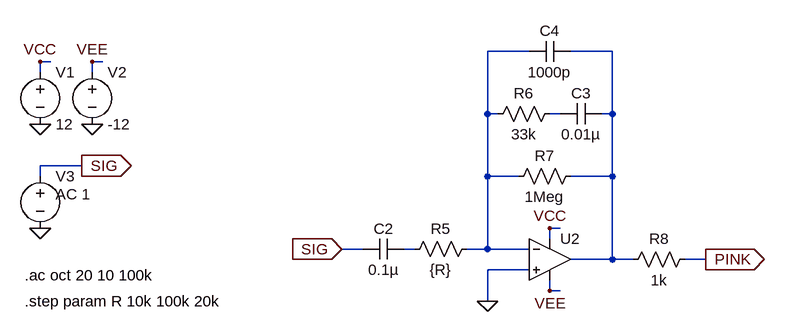
[diagram p0: schematic NOS02_Pink.asc]
NOS02_Pink.asc, the LTspice schematic file:
Version 4
SHEET 1 1352 1156
WIRE 272 -480 208 -480
WIRE 400 -480 336 -480
WIRE -464 -464 -480 -464
WIRE -384 -464 -400 -464
WIRE -480 -448 -480 -464
WIRE -400 -448 -400 -464
WIRE 208 -384 208 -480
WIRE 224 -384 208 -384
WIRE 320 -384 304 -384
WIRE 400 -384 400 -480
WIRE 400 -384 384 -384
WIRE -416 -304 -480 -304
WIRE -480 -288 -480 -304
WIRE 208 -288 208 -384
WIRE 256 -288 208 -288
WIRE 400 -288 400 -384
WIRE 400 -288 336 -288
WIRE 320 -208 304 -208
WIRE 304 -192 304 -208
WIRE 16 -176 -16 -176
WIRE 96 -176 80 -176
WIRE 208 -176 208 -288
WIRE 208 -176 176 -176
WIRE 272 -176 208 -176
WIRE 400 -160 400 -288
WIRE 400 -160 336 -160
WIRE 432 -160 400 -160
WIRE 544 -160 512 -160
WIRE 272 -144 208 -144
WIRE 304 -112 304 -128
WIRE 320 -112 304 -112
WIRE 208 -96 208 -144
FLAG 304 -208 VCC
FLAG 304 -112 VEE
FLAG 208 -96 0
FLAG -16 -176 SIG
IOPIN -16 -176 In
FLAG 544 -160 PINK
IOPIN 544 -160 Out
FLAG -480 -368 0
FLAG -400 -368 0
FLAG -480 -464 VCC
FLAG -400 -464 VEE
FLAG -416 -304 SIG
IOPIN -416 -304 Out
FLAG -480 -208 0
SYMBOL Opamps\\UniversalOpamp2 304 -160 R0
SYMATTR InstName U2
SYMBOL res 192 -192 R90
WINDOW 0 0 56 VBottom 2
WINDOW 3 32 56 VTop 2
SYMATTR InstName R5
SYMATTR Value {R}
SYMBOL cap 80 -192 R90
WINDOW 0 0 32 VBottom 2
WINDOW 3 32 32 VTop 2
SYMATTR InstName C2
SYMATTR Value 0.1µ
SYMBOL res 320 -400 R90
WINDOW 0 0 56 VBottom 2
WINDOW 3 32 56 VTop 2
SYMATTR InstName R6
SYMATTR Value 33k
SYMBOL res 352 -304 R90
WINDOW 0 0 56 VBottom 2
WINDOW 3 32 56 VTop 2
SYMATTR InstName R7
SYMATTR Value 1Meg
SYMBOL res 528 -176 R90
WINDOW 0 0 56 VBottom 2
WINDOW 3 32 56 VTop 2
SYMATTR InstName R8
SYMATTR Value 1k
SYMBOL cap 384 -400 R90
WINDOW 0 0 32 VBottom 2
WINDOW 3 32 32 VTop 2
SYMATTR InstName C3
SYMATTR Value 0.01µ
SYMBOL cap 336 -496 R90
WINDOW 0 0 32 VBottom 2
WINDOW 3 32 32 VTop 2
SYMATTR InstName C4
SYMATTR Value 1000p
SYMBOL voltage -480 -464 R0
WINDOW 123 0 0 Left 0
WINDOW 39 0 0 Left 0
SYMATTR InstName V1
SYMATTR Value 12
SYMBOL voltage -400 -464 R0
WINDOW 123 0 0 Left 0
WINDOW 39 0 0 Left 0
SYMATTR InstName V2
SYMATTR Value -12
SYMBOL voltage -480 -304 R0
WINDOW 123 24 44 Left 2
WINDOW 39 0 0 Left 0
SYMATTR Value2 AC 1
SYMATTR InstName V3
SYMATTR Value ""
TEXT -504 -136 Left 2 !.ac oct 20 10 100k
TEXT -504 -96 Left 2 !.step param R 10k 100k 20k

The netlist it stands for:
* NOS02_Pink.asc
XU2 0 N001 VCC VEE N002 level.2 Avol=1Meg GBW=10Meg Slew=10Meg ilimit=25m rail=0 Vos=0 phimargin=45 en=0 enk=0 in=0 ink=0 Rin=500Meg  ; pins IN+ IN- V+ V- OUT
R5 N001 N004 {R}
C2 N004 SIG 0.1µ
R6 N003 N001 33k
R7 N002 N001 1Meg
R8 PINK N002 1k
C3 N002 N003 0.01µ
C4 N002 N001 1000p
V1 VCC 0 12
V2 VEE 0 -12
V3 SIG 0 AC 1
.ac oct 20 10 100k
.step param R 10k 100k 20k
.lib UniversalOpamps2.sub
.backanno
.end